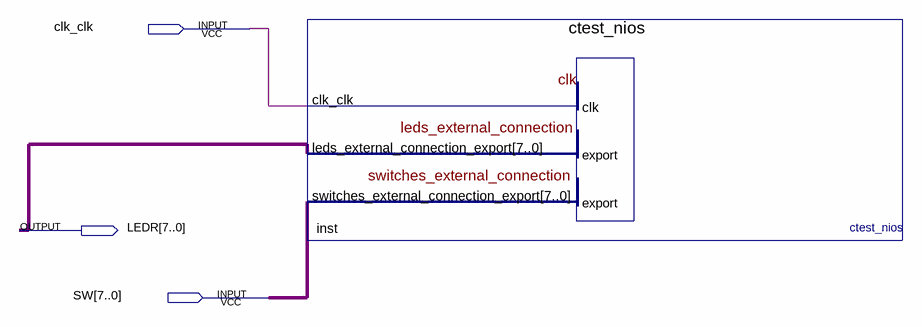
[diagram p0: schematic sheet]
// Quartus schematic ctest.bdf as structural Verilog: 1 symbols, 3 pins
module ctest (
  input  clk_clk,
  input  [7:0] SW,
  output [7:0] LEDR
);

  ctest_nios inst (.clk_clk(clk_clk), .switches_external_connection_export(SW), .leds_external_connection_export(LEDR));
endmodule
